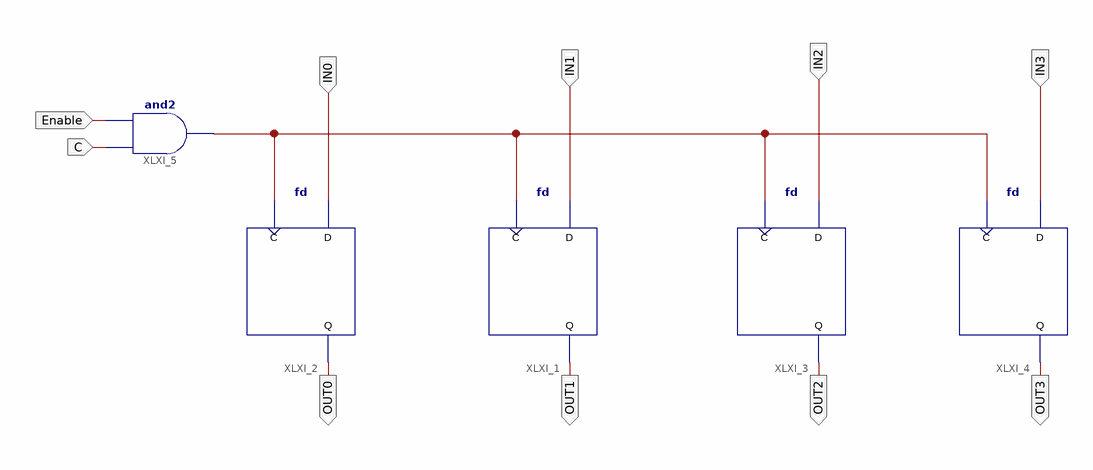
[diagram p0: schematic sheet 1]
// Xilinx ISE schematic Reg_4.sch (spartan3e) as structural Verilog: 5 symbols, 10 ports
module Reg_4 (
  input  Enable,
  input  C,
  input  IN0,
  input  IN1,
  input  IN2,
  input  IN3,
  output OUT0,
  output OUT1,
  output OUT2,
  output OUT3
);

  wire XLXN_1;

  fd XLXI_1 (.C(XLXN_1), .D(IN1), .Q(OUT1));
  fd XLXI_2 (.C(XLXN_1), .D(IN0), .Q(OUT0));
  fd XLXI_3 (.C(XLXN_1), .D(IN2), .Q(OUT2));
  fd XLXI_4 (.C(XLXN_1), .D(IN3), .Q(OUT3));
  and XLXI_5 (XLXN_1, C, Enable);
endmodule
